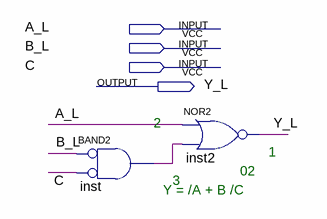
[diagram p0: schematic sheet]
// Quartus schematic R_per6.bdf as structural Verilog: 2 symbols, 4 pins
module R_per6 (
  input  A_L,
  input  B_L,
  input  C,
  output Y_L
);

  wire inst_out;

  and inst (inst_out, ~B_L, ~C);  // BAND2
  nor inst2 (Y_L, A_L, inst_out);

  // Notes on the sheet:
  //   2
  //   1
  //   02
  //   3
  //   Y = /A + B /C
endmodule
